# Altium schematic sheet OMD_CAN_VERT.SchDoc
size A4; Organization: Altium Limited; Address1: L3, 12a Rodborough Rd; Address2: Frenchs Forest; Address3: NSW; Address4: Australia 2086
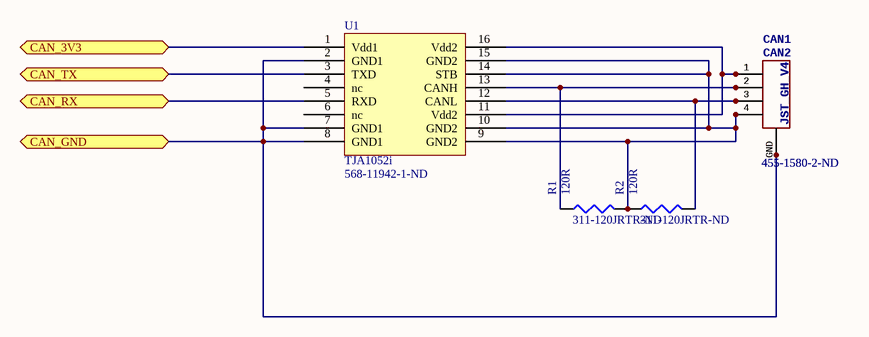
[diagram p0: OMD_CAN_VERT.SchDoc]

## Parts
CAN1  JST_GH_V4  Supplier Part Number 1: 455-1580-2-ND  [JST_GH_V4]
CAN2  JST_GH_V4  Supplier Part Number 1: 455-1580-2-ND  [JST_GH_V4]
R1  value 120R  Supplier Part Number 1: 311-120JRTR-ND  [R0402]  (hidden comment: RES SMD 120 OHM 5% 1/16W 0402)  (no BOM)
R2  value 120R  Supplier Part Number 1: 311-120JRTR-ND  [R0402]  (hidden comment: RES SMD 120 OHM 5% 1/16W 0402)  (no BOM)
U1  TJA1052i  Supplier Part Number 1: 568-11942-1-ND  [TJA1052i]

## Ports
CAN_3V3, CAN_GND, CAN_RX, CAN_TX

## Nets
CAN_3V3: U1.1(Vdd1) ; port CAN_3V3
CAN_GND: CAN1.GND CAN2.GND U1.2(GND1) U1.7(GND1) U1.8(GND1) ; port CAN_GND
CAN_RX: U1.5(RXD) ; port CAN_RX
CAN_TX: U1.3(TXD) ; port CAN_TX
NetCAN1_1: CAN1.1 CAN2.1 U1.11(Vdd2) U1.16(Vdd2)
NetCAN1_2: CAN1.2 CAN2.2 R1.1 U1.13(CANH)
NetCAN1_3: CAN1.3 CAN2.3 R2.2 U1.12(CANL)
NetCAN1_4: CAN1.4 CAN2.4 R1.2 R2.1 U1.9(GND2) U1.10(GND2) U1.14(STB) U1.15(GND2)

Not connected (* = marked no-connect by the designer): U1 4(nc) 6(nc)

## Notes on the sheet
- https://github.com/OpenMotorDrive
- https://creativecommons.org/licenses/by-nc-sa/4.0/
- For Commercial use, please contact ProfiCNC
- Title
- Size:
- Date:
- A4
- Number:
- Time:
- Revision:
- Sheet
- of
- ProfiCNC Pty. Ltd.
- ProfiCNC does NOT guaranty these drawings as fit for any purpose, you must verify this information before attempting to use it in any way.  USE AT OWN RISK
- File:

## Library data of the parts
CAN1 CAN2 = JST_GH_V4: BM04B-GHS-TBT; Supplier 1: Digi-Key
R1 R2 = Resistor: Supplier 1: Digi-Key
U1 = TJA1052i: Supplier 1: Digi-Key